# Altium schematic sheet Схема структурная BlueTractorV1.1-2021.SchDoc
size 420 x 297 mm; Address1: Address1; Address2: Address2; Address3: Address3; Address4: Address4; DocumentNumber: АБВГ.123456.001 Э3; SheetNumber: 1; Scale: 1:1; DocumentType: Схема электрическая принципиальная; FirstReferrence: АБВГ.123456.001
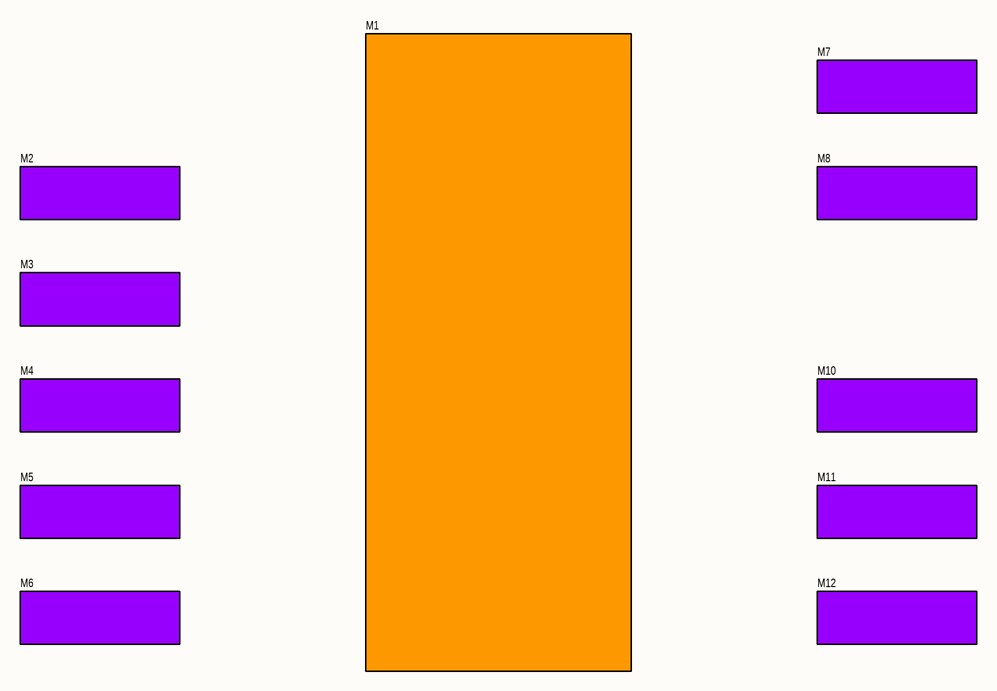
[diagram p0: Схема структурная BlueTractorV1.1-2021.SchDoc]

## Sub-sheets
M1 = File Name: no entries
M2 = File Name: no entries
M3 = File Name: no entries
M4 = File Name: no entries
M5 = File Name: no entries
M6 = File Name: no entries
M7 = File Name: no entries
M8 = File Name: no entries
M10 = File Name: no entries
M11 = File Name: no entries
M12 = File Name: no entries

## Notes on the sheet
- Перв. примен.
- Справ. №
- Подп. и дата
- Инв. № дубл.
- Взам. инв. №
- Разраб.
- Изм.
- Лист
- № докум.
- Подп.
- Дата
- Лит.
- Масса
- Масштаб
- Пров.
- Т.контр.
- Листов
- Инв. № подл.
- Утв.
- Н.контр.
- 2.106-A3
- Копировал
- Формат А3